# Altium project Game_Boy_Reverse_Engineering_For_Link_Port.PrjPcb
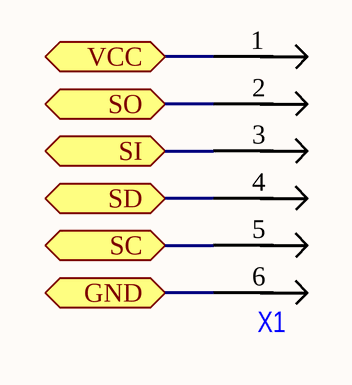
[diagram p0: Game_Boy_Reverse_Engineering_For_Link_Port.SchDoc]
1 sheet, 1 parts. Net scope: flat (ports and power ports of the same name join across sheets).
Board file: Game_Boy_Reverse_Engineering_For_Link_Port.PcbDoc

## Sheet Game_Boy_Reverse_Engineering_For_Link_Port.SchDoc
size A

### Parts
X1  (no value)  [PLDR-6]

### Ports
GND, SC, SD, SI, SO, VCC

### Nets
NetX1_1: X1.1 ; port VCC
NetX1_2: X1.2 ; port SO
NetX1_3: X1.3 ; port SI
NetX1_4: X1.4 ; port SD
NetX1_5: X1.5 ; port SC
NetX1_6: X1.6 ; port GND

### Library data of the parts
X1 = ??: Part number: разъем PLDR-6; ID 1C: ??; Type: разъем